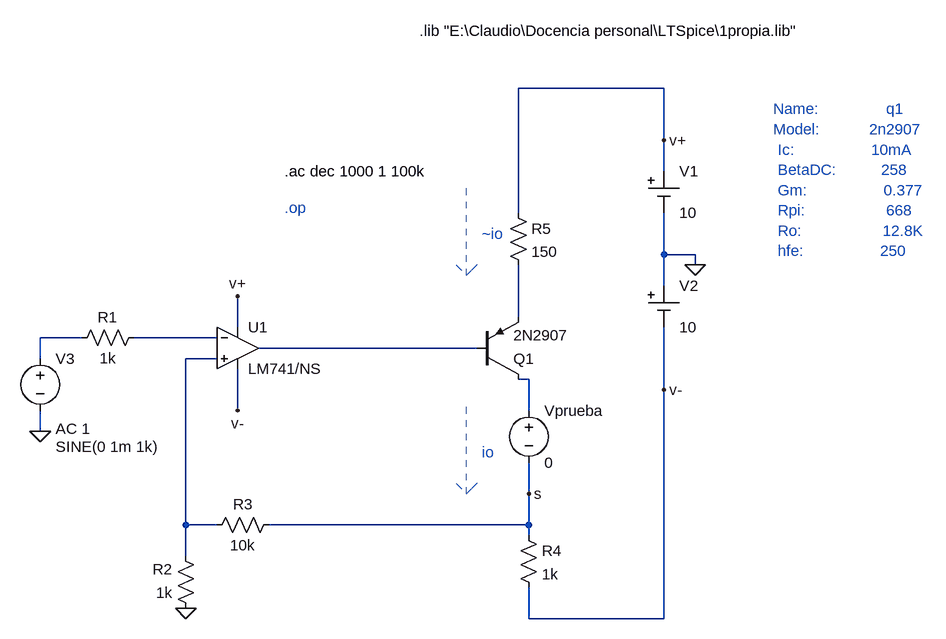
[diagram p0: schematic real_T4xx.asc]
real_T4xx.asc, the LTspice schematic file:
Version 4
SHEET 1 1704 1092
WIRE 880 -288 656 -288
WIRE 880 -208 880 -288
WIRE 880 -160 880 -208
WIRE 656 -96 656 -288
WIRE 880 -32 880 -96
WIRE 928 -32 880 -32
WIRE 928 -16 928 -32
WIRE 880 16 880 -32
WIRE 656 64 656 -16
WIRE 224 80 224 32
WIRE -16 96 -80 96
WIRE 192 96 64 96
WIRE 592 112 256 112
WIRE -80 128 -80 96
WIRE 192 128 144 128
WIRE 672 160 656 160
WIRE 880 176 880 80
WIRE 224 208 224 144
WIRE 672 208 672 160
WIRE -80 240 -80 208
WIRE 672 336 672 288
WIRE 144 384 144 128
WIRE 192 384 144 384
WIRE 672 384 672 336
WIRE 672 384 272 384
WIRE 672 400 672 384
WIRE 144 432 144 384
WIRE 672 528 672 480
WIRE 880 528 880 176
WIRE 880 528 672 528
FLAG -80 240 0
FLAG 144 512 0
FLAG 928 -16 0
FLAG 880 -208 v+
FLAG 880 176 v-
FLAG 672 336 s
FLAG 224 32 v+
FLAG 224 208 v-
SYMBOL res 80 80 R90
WINDOW 0 0 56 VBottom 2
WINDOW 3 32 56 VTop 2
SYMATTR InstName R1
SYMATTR Value 1k
SYMBOL res 160 528 R180
WINDOW 0 36 76 Left 2
WINDOW 3 36 40 Left 2
SYMATTR InstName R2
SYMATTR Value 1k
SYMBOL res 176 400 R270
WINDOW 0 32 56 VTop 2
WINDOW 3 0 56 VBottom 2
SYMATTR InstName R3
SYMATTR Value 10k
SYMBOL res 656 384 R0
SYMATTR InstName R4
SYMATTR Value 1k
SYMBOL pnp 592 160 M180
SYMATTR InstName Q1
SYMATTR Value 2N2907
SYMBOL res 640 -112 R0
SYMATTR InstName R5
SYMATTR Value 150
SYMBOL OpAmps\\opamp2 224 48 R0
SYMATTR InstName U1
SYMATTR Value LM741/NS
SYMBOL Misc\\cell 880 -160 R0
WINDOW 123 0 0 Left 0
WINDOW 39 0 0 Left 0
SYMATTR InstName V1
SYMATTR Value 10
SYMBOL Misc\\cell 880 16 R0
WINDOW 123 0 0 Left 0
WINDOW 39 0 0 Left 0
SYMATTR InstName V2
SYMATTR Value 10
SYMBOL voltage -80 112 R0
WINDOW 3 24 152 Left 2
WINDOW 123 24 124 Left 2
WINDOW 39 0 0 Left 0
SYMATTR Value SINE(0 1m 1k)
SYMATTR Value2 AC 1
SYMATTR InstName V3
SYMBOL voltage 672 192 R0
WINDOW 123 0 0 Left 0
WINDOW 39 0 0 Left 0
SYMATTR InstName Vprueba
SYMATTR Value 0
TEXT 296 -104 Left 2 ;.op
TEXT 1048 -256 Left 2 ;Name:               q1\nModel:           2n2907\n Ic:                 10mA\n BetaDC:          258\n Gm:                 0.377 \n Rpi:                  668\n Ro:                  12.8K\n hfe:                 250
TEXT 504 -376 Left 2 !.lib "E:\\Claudio\\Docencia personal\\LTSpice\\1propia.lib"
TEXT 600 272 Left 2 ;io
TEXT 600 -64 Left 2 ;~io
TEXT 296 -160 Left 2 !.ac dec 1000 1 100k
LINE Normal 576 336 576 192 2
LINE Normal 592 320 576 336 2
LINE Normal 576 336 592 320 2
LINE Normal 560 320 576 336 2
LINE Normal 576 0 576 -144 2
LINE Normal 592 -16 576 0 2
LINE Normal 576 0 592 -16 2
LINE Normal 560 -16 576 0 2

The netlist it stands for:
* real_T4xx.asc
R1 N003 N002 1k
R2 0 N005 1k
R3 N005 s 10k
R4 s v- 1k
Q1 N006 N004 N001 0 2N2907
R5 v+ N001 150
XU1 N005 N003 v+ v- N004 LM741/NS  ; pins In+ In- V+ V- OUT
V1 v+ 0 10
V2 0 v- 10
V3 N002 0 SINE(0 1m 1k) AC 1
Vprueba N006 s 0
.model NPN NPN
.model PNP PNP
.lib standard.bjt
* .op
* Name:               q1
* Model:           2n2907
*  Ic:                 10mA
*  BetaDC:          258
*  Gm:                 0.377
*  Rpi:                  668
*  Ro:                  12.8K
*  hfe:                 250
.lib "E:\Claudio\Docencia personal\LTSpice\1propia.lib"
* io
* ~io
.ac dec 1000 1 100k
.backanno
.end